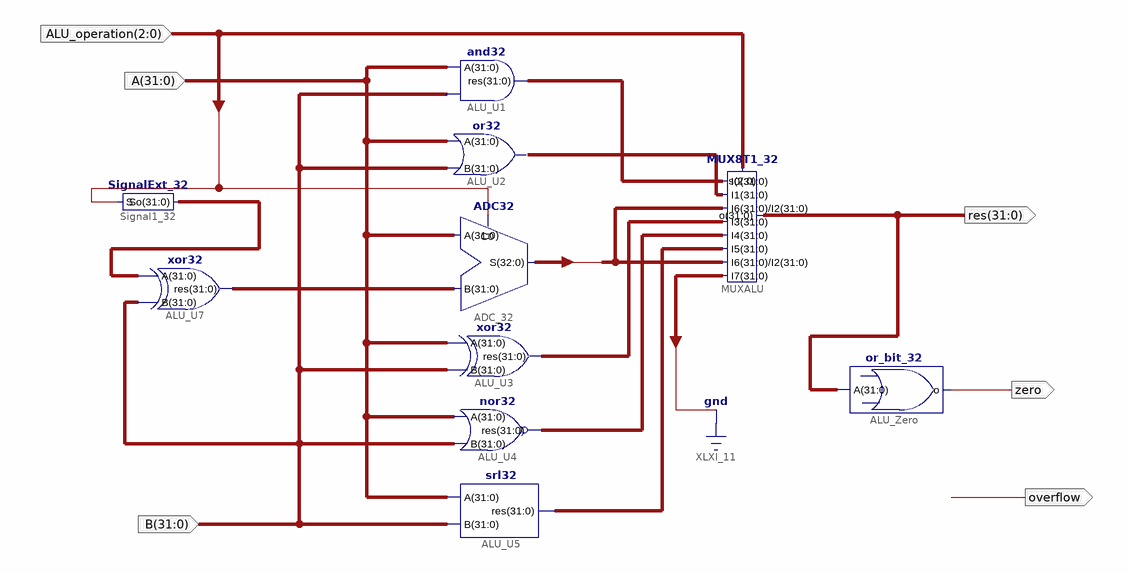
[diagram p0: schematic sheet 1]
// Xilinx ISE schematic ALU.sch (kintex7) as structural Verilog: 10 symbols, 6 ports
module ALU (
  input  [31:0] A,
  input  [31:0] B,
  input  [2:0] ALU_operation,
  output overflow,
  output [31:0] res,
  output zero
);

  wire [31:0] XLXN_5, XLXN_10, XLXN_11, XLXN_12, XLXN_16, XLXN_17, XLXN_18;
  wire [32:0] S;

  ADC32 ADC_32 (.B(XLXN_5), .A(A), .C0(ALU_operation[2]), .S(S));
  MUX8T1_32 MUXALU (
    .s(ALU_operation), .I7({{31{1'b0}}, S[31]}), .I6(S[31:0]), .I5(XLXN_18), .I4(XLXN_17), .I3(XLXN_16),
    .I2(S[31:0]), .I1(XLXN_12), .I0(XLXN_11), .o(res));
  or32 ALU_U2 (.res(XLXN_12), .A(A), .B(B));
  and32 ALU_U1 (.res(XLXN_11), .A(A), .B(B));
  xor32 ALU_U3 (.A(A), .B(B), .res(XLXN_16));
  nor32 ALU_U4 (.res(XLXN_17), .A(A), .B(B));
  srl32 ALU_U5 (.A(A), .B(B), .res(XLXN_18));
  or_bit_32 ALU_Zero (.o(zero), .A(res));
  xor32 ALU_U7 (.A(XLXN_10), .B(B), .res(XLXN_5));
  SignalExt_32 Signal1_32 (.So(XLXN_10), .S(ALU_operation[2]));
endmodule
